# Altium schematic sheet LED.SchDoc
size A4
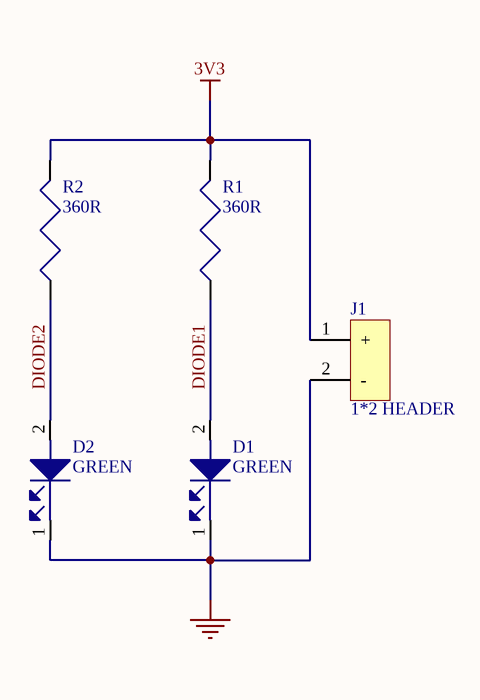
[diagram p0: LED.SchDoc]

## Parts
D1  GREEN  [LED0603G]
D2  GREEN  [LED0603G]
J1  1*2 HEADER  [HEADER1X2]
R1  360R  [R0805]
R2  360R  [R0805]

## Nets
3V3: J1.1(+) R1.2 R2.2
GND: D1.1 D2.1 J1.2(-)
DIODE1: D1.2 R1.1
DIODE2: D2.2 R2.1

## Library data of the parts
D1 D2 = 150060VS55040: Standard LEDs - SMD WL-SMCD SMD MonoChip 0603 BrtGrn 575nm; Manufacturer: Wurth Elektronik; Lens Shape: Rectangle; Luminous Intensity: 60 mcd; Viewing Angle: 140 deg; If - Forward Current: 20 mA; Lens Transparency: Diffused; Vf - Forward Voltage: 2 V; Supplier 1: Mouser; Supplier Part Number 1: 710-150060VS55040; Manufacturer Part Number: 150060VS55040; RoHS: RoHS Compliant; Category: Standard LEDs - SMD; Stock 1: 27628; Pricing 1: 1=0.243, 10=0.219, 100=0.198, 500=0.178, 1000=0.158, 4000=0.158 (AUD); Height: 0.4 mm; Illumination Color: Green; Length: 1.6 mm; Orientation: Top View; Package / Case: 0603 (1608 metric); Packaging: Cut Tape; Product: Green LEDs; Series: WL-SMCD; Width: 0.8 mm; Brand: Wurth Elektronik; Mounting Style: SMD/SMT; Maximum Operating Temperature: + 85 C; Minimum Operating Temperature: - 40 C; Moisture Sensitive: Yes; Product Type: LED - Standard; Standard Pack Qty: 4000; Subcategory: LEDs; Wavelength/Color Temperature: 575 nm; RoHS - Mouser: Y; Minimum Order Quantity: 1; Reeling: True; ComponentLink1URL: https://www.mouser.com/datasheet/2/445/150060VS55040-1715060.pdf; ComponentLink1Description: https://www.mouser.com/datasheet/2/445/150060VS55040-1715060.pdf; Case Code - in: 0603; Case Code - mm: 1608
J1 = 22-11-2026: Headers & Wire Housings KK 100 Hdr FrLk Vert 02 Ckt Gold; Manufacturer: Molex; Current Rating: 4 A; Mounting Angle: Straight; Number of Positions: 2 Position; Voltage Rating: 250 V; Pitch: 2.54 mm; Latching Type: Unlatched; Supplier 1: Mouser; Manufacturer Part Number: 22-11-2026; RoHS: RoHS Compliant; Category: Headers & Wire Housings; Stock 1: 13998; Pricing 1: 1=0.290, 10=0.256, 100=0.192, 500=0.166, 1000=0.138, 3000=0.118, 9000=0.110, 24000=0.107, 45000=0.103 (AUD); Accessory Type: -; Contact Plating: Gold; Contact Type: -; Housing Material: Nylon; Number of Rows: 1 Row; Product: Headers; Series: 6373; Termination Style: Solder Pin; Type: Locking; Brand: Molex; Contact Material: Brass; Mounting Style: Through Hole; Row Spacing: -; Contact Gender: Pin (Male); Housing Color: White; Product Type: Headers & Wire Housings; Standard Pack Qty: 24000; Subcategory: Headers & Wire Housings; Tradename: KK; RoHS - Mouser: Y; Minimum Order Quantity: 1; Reeling: False; ComponentLink1URL: https://www.mouser.com/datasheet/2/276/022045042_sd-206842.pdf; ComponentLink1Description: https://www.mouser.com/datasheet/2/276/022045042_sd-206842.pdf; Supplier Part Number 1: 538-22-11-2026
R1 R2 = CR0805-JW-361ELF: Thick Film Resistors - SMD 360ohm 5%; Manufacturer: Bourns; Power Rating: 125 mW (1/8 W); Resistance: 360 Ohms; Temperature Coefficient: 200 PPM / C; Voltage Rating: 150 V; Supplier 1: Mouser; Supplier Part Number 1: 652-CR0805JW-361ELF; Manufacturer Part Number: CR0805-JW-361ELF; RoHS: RoHS Compliant By Exemption; Category: Thick Film Resistors - SMD; Stock 1: 71738; Pricing 1: 1=0.135, 10=0.031, 100=0.018, 500=0.014, 1000=0.011, 5000=0.007, 10000=0.005, 50000=0.004 (AUD); Features: -; Height: 0.5 mm; Length: 2 mm; Package / Case: 0805; Packaging: Cut Tape; Product: Thick Film Resistors SMD; Series: CR0805; Technology: Thick Film; Termination Style: SMD/SMT; Tolerance: 5 %; Type: General Purpose; Width: 1.25 mm; Brand: Bourns; Mounting Style: PCB Mount; Case Code - in: 0805; Case Code - mm: 2012; Maximum Operating Temperature: + 155 C; Minimum Operating Temperature: - 55 C; Product Type: Thick Film Resistors; Standard Pack Qty: 5000; Subcategory: Resistors; RoHS - Mouser: E; Minimum Order Quantity: 1; Reeling: True; ComponentLink1URL: https://www.mouser.com/datasheet/2/54/crxxxxx-1858361.pdf; ComponentLink1Description: https://www.mouser.com/datasheet/2/54/crxxxxx-1858361.pdf